# EAGLE design pcb2 (EAGLE 8.0.0)
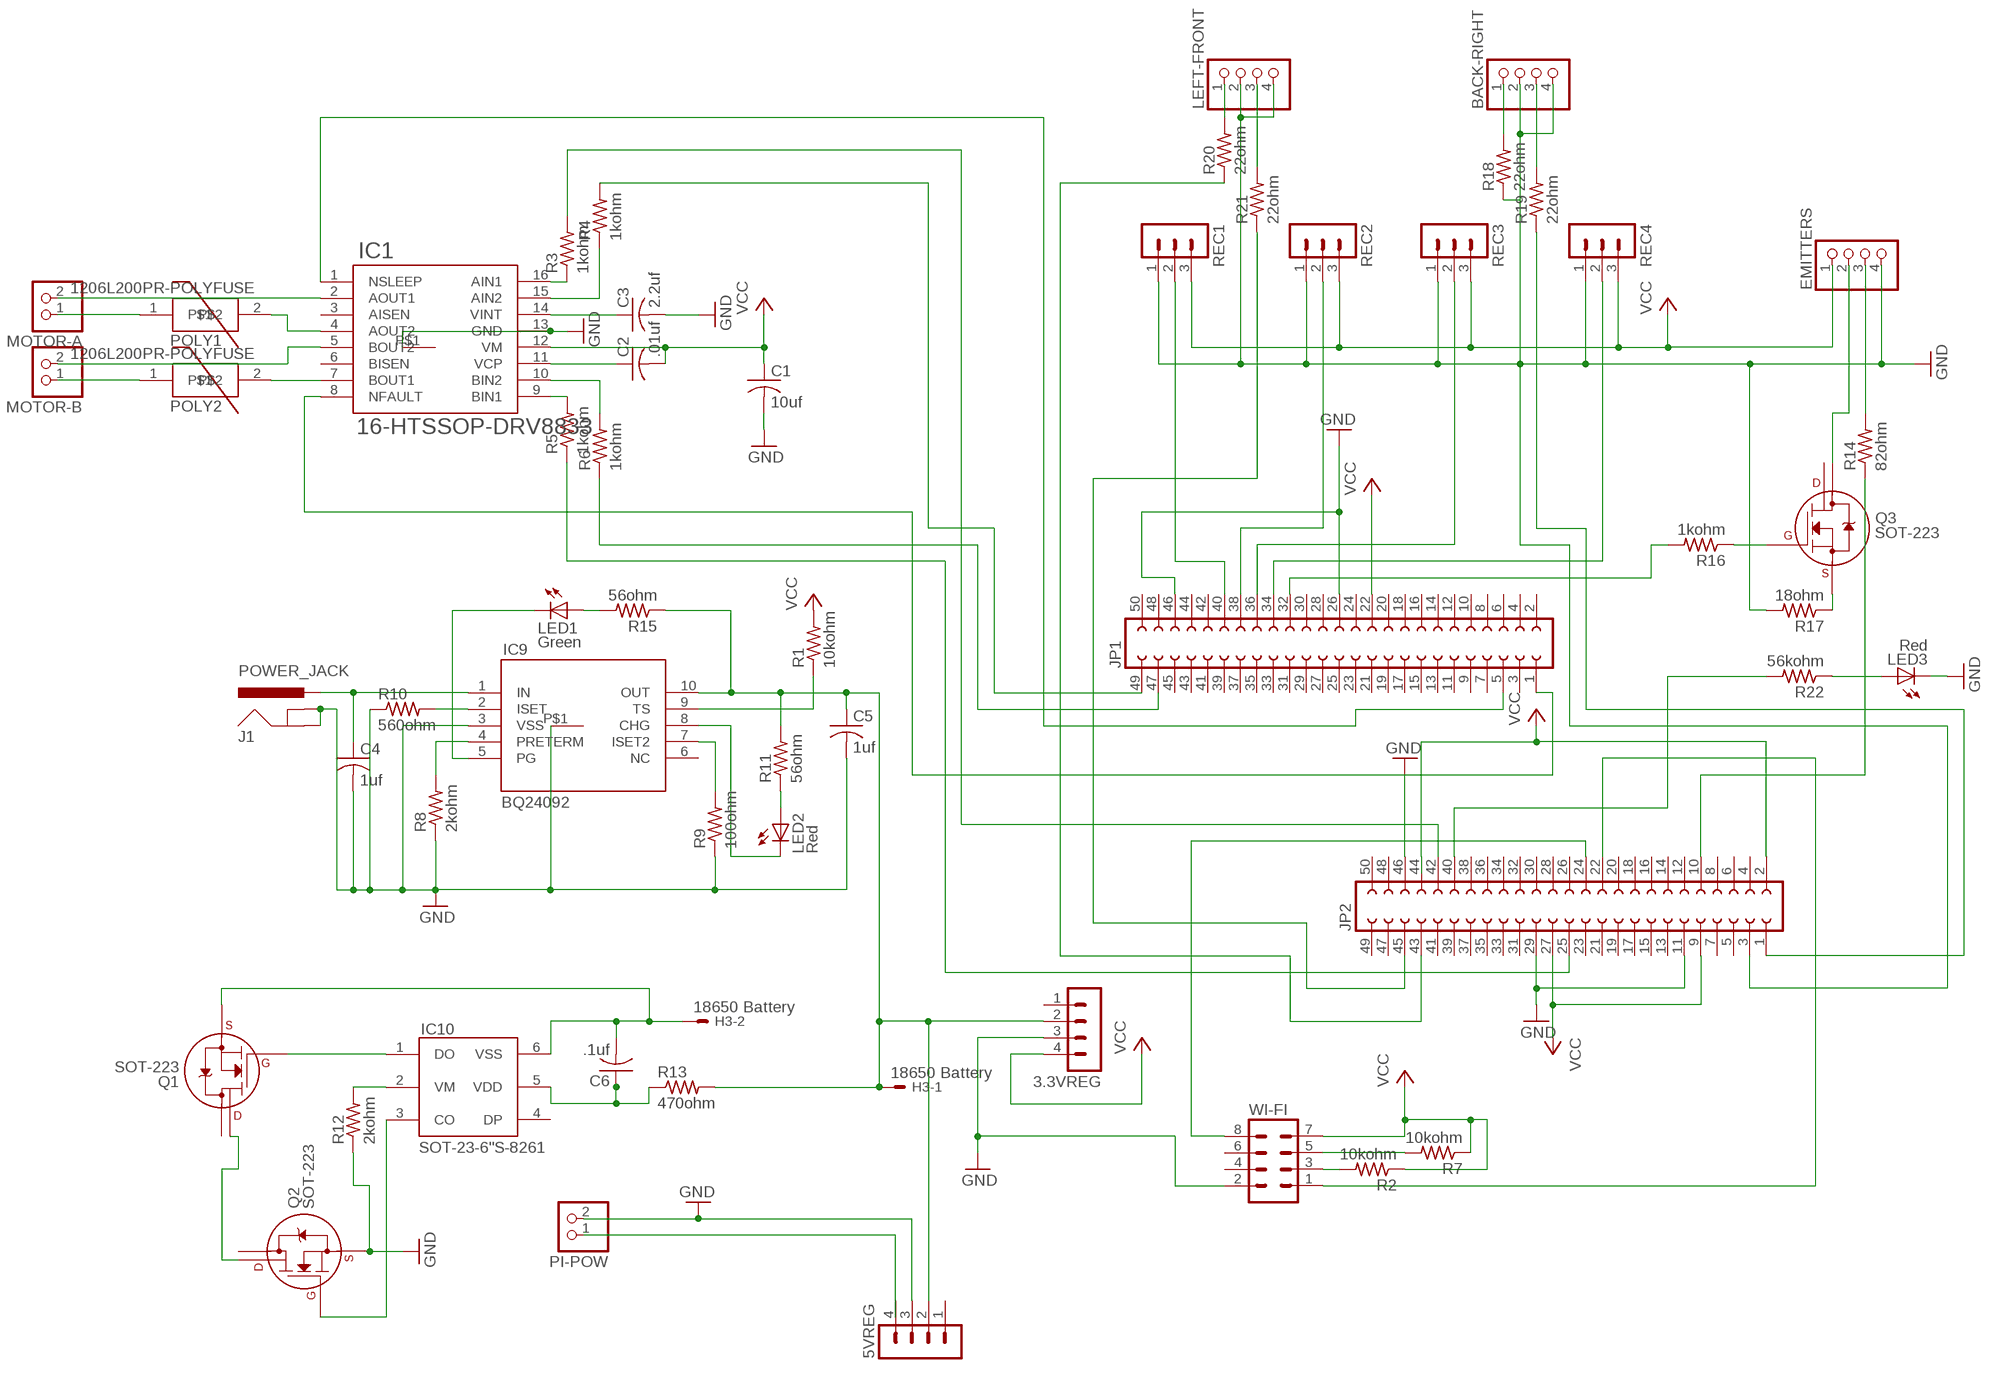
[diagram p0: schematic, sheet 1]

## Parts
3.3VREG  MA04-1  [MA04-1]
5VREG  MA04-1  [MA04-1]
BACK-RIGHT  PINHD-1X4  [1X04]
C1  10uf  C-USC0805  [C0805]
C2  .01uf  C-USC0805  [C0805]
C3  2.2uf  C-USC1206  [C1206]
C4  1uf  C-USC1206  [C1206]
C5  1uf  C-USC1206  [C1206]
C6  .1uf  C-USC1206  [C1206]
EMITTERS  PINHD-1X4  [1X04]
H3  18650 Battery  KK-156-2  [KK-156-2]
IC1  16-HTSSOP-DRV8833  [TSSOP16E]
IC9  BQ24092  [DFN10-3X3]
IC10  SOT-23-6"S-8261  [SOT23-6]
J1  POWER_JACK  [POWER_JACK_PTH]
JP1  FE25-2  [FE25-2]
JP2  FE25-2  [FE25-2]
LED1  Green  LEDCHIPLED_0805  [CHIPLED_0805]
LED2  Red  LEDCHIPLED_0805  [CHIPLED_0805]
LED3  Red  LEDCHIPLED_0805  [CHIPLED_0805]
LEFT-FRONT  PINHD-1X4  [1X04]
MOTOR-A  PINHD-1X2  [1X02]
MOTOR-B  PINHD-1X2  [1X02]
PI-POW  PINHD-1X2  [1X02]
POLY1  1206L200PR-POLYFUSE  [R1206]
POLY2  1206L200PR-POLYFUSE  [R1206]
Q1  SOT-223  IRLL014  [SOT-223]
Q2  SOT-223  IRLL014  [SOT-223]
Q3  SOT-223  IRLL014  [SOT-223]
R1  10kohm  R-US_R0805  [R0805]
R2  10kohm  R-US_R0805  [R0805]
R3  1kohm  R-US_R0805  [R0805]
R4  1kohm  R-US_R0805  [R0805]
R5  1kohm  R-US_R0805  [R0805]
R6  1kohm  R-US_R0805  [R0805]
R7  10kohm  R-US_R0805  [R0805]
R8  2kohm  R-US_R1206  [R1206]
R9  100ohm  R-US_R0805  [R0805]
R10  560ohm  R-US_R1206  [R1206]
R11  56ohm  R-US_R1206  [R1206]
R12  2kohm  R-US_R0805  [R0805]
R13  470ohm  R-US_R1206  [R1206]
R14  82ohm  R-US_R1206  [R1206]
R15  56ohm  R-US_R1206  [R1206]
R16  1kohm  R-US_R1206  [R1206]
R17  18ohm  R-US_R1206  [R1206]
R18  22ohm  R-US_R1206  [R1206]
R19  22ohm  R-US_R1206  [R1206]
R20  22ohm  R-US_R1206  [R1206]
R21  22ohm  R-US_R1206  [R1206]
R22  56kohm  R-US_R0805  [R0805]
REC1  MA03-1  [MA03-1]
REC2  MA03-1  [MA03-1]
REC3  MA03-1  [MA03-1]
REC4  MA03-1  [MA03-1]
WI-FI  MA04-2  [MA04-2]

## Nets
GND: 3.3VREG.3 5VREG.3 BACK-RIGHT.2 BACK-RIGHT.4 C1.2 C3.2 C4.2 C5.2 EMITTERS.4 IC1.13(GND) IC1.P$1 IC9.3(VSS) IC9.P$1 J1.GND J1.GNDBREAK JP1.26 JP1.46 JP2.11 JP2.29 JP2.46 LED3.C LEFT-FRONT.2 LEFT-FRONT.4 PI-POW.2 Q2.3(S) R8.1 R9.1 R10.1 R12.1 R17.2 REC1.1 REC2.1 REC3.1 REC4.1 WI-FI.2
N$1: C3.1 IC1.14(VINT)
N$2: IC10.2(VM) R12.2
N$3: C2.1 IC1.11(VCP)
N$4: IC1.16(AIN1) R3.1
N$5: IC1.15(AIN2) R4.1
N$6: IC9.5(PG) LED1.C
N$7: LED1.A R15.2
N$8: IC9.8(CHG) LED2.C
N$9: LED2.A R11.1
N$10: IC9.2(ISET) R10.2
N$11: IC9.4(PRETERM) R8.2
N$12: IC10.1(DO) Q1.1(G)
N$13: C4.1 IC9.1(IN) J1.PWR
N$14: IC1.9(BIN1) R5.2
N$15: IC10.3(CO) Q2.1(G)
N$16: Q1.4(D2) Q2.4(D2)
N$17: IC9.7(ISET2) R9.2
N$18: C6.2 H3.2 IC10.6(VSS) Q1.3(S)
N$19: Q3.1(G) R16.1
N$20: IC1.10(BIN2) R6.2
N$21: C6.1 IC10.5(VDD) R13.1
N$22: JP2.10 R14.1
N$23: 5VREG.4 PI-POW.1
N$24: EMITTERS.3 R14.2
N$25: IC1.2(AOUT1) MOTOR-A.2
N$26: JP2.24 WI-FI.8
N$27: JP1.40 REC1.2
N$28: JP2.22 WI-FI.1
N$29: JP2.42 R3.2
N$30: JP1.49 R4.2
N$31: JP1.47 R6.1
N$32: JP2.25 R5.1
N$33: IC1.4(AOUT2) POLY1.2
N$34: IC1.5(BOUT2) MOTOR-B.2
N$35: MOTOR-A.1 POLY1.1
N$36: IC9.9(TS) R1.1
N$37: R2.2 WI-FI.3
N$38: 3.3VREG.2 5VREG.2 C5.1 H3.1 IC9.10(OUT) R11.2 R13.2 R15.1
N$39: R7.2 WI-FI.5
N$40: JP1.34 REC4.2
N$41: JP1.36 REC3.2
N$42: JP1.38 REC2.2
N$43: EMITTERS.2 Q3.2(D1)
N$46: MOTOR-B.1 POLY2.1
N$47: IC1.7(BOUT1) POLY2.2
N$48: JP1.32 R16.2
N$49: BACK-RIGHT.1 R18.2
N$50: Q3.3(S) R17.1
N$51: BACK-RIGHT.3 R19.2
N$52: LEFT-FRONT.1 R20.2
N$53: LEFT-FRONT.3 R21.2
N$54: JP2.3 R18.1
N$55: IC1.1(NSLEEP) JP1.5
N$56: IC1.8(NFAULT) JP1.1
N$57: JP2.40 R22.2
N$59: JP2.45 R21.1
N$60: JP2.43 R20.1
N$61: JP2.1 R19.1
N$64: LED3.A R22.1
VCC: 3.3VREG.4 C1.1 C2.2 EMITTERS.1 IC1.12(VM) JP1.22 JP2.2 JP2.9 JP2.27 JP2.44 R1.2 R2.1 R7.1 REC1.3 REC2.3 REC3.3 REC4.3 WI-FI.7
Unconnected: 3.3VREG.1 5VREG.1 IC1.3(AISEN) IC1.6(BISEN) IC9.6(NC) IC10.4(DP) JP1.2 JP1.3 JP1.4 JP1.6 JP1.7 JP1.8 JP1.9 JP1.10 JP1.11 JP1.12 JP1.13 JP1.14 JP1.15 JP1.16 JP1.17 JP1.18 JP1.19 JP1.20 JP1.21 JP1.23 JP1.24 JP1.25 JP1.27 JP1.28 JP1.29 JP1.30 JP1.31 JP1.33 JP1.35 JP1.37 JP1.39 JP1.41 JP1.42 JP1.43 JP1.44 JP1.45 JP1.48 JP1.50 JP2.4 JP2.5 JP2.6 JP2.7 JP2.8 JP2.12 JP2.13 JP2.14 JP2.15 JP2.16 JP2.17 JP2.18 JP2.19 JP2.20 JP2.21 JP2.23 JP2.26 JP2.28 JP2.30 JP2.31 JP2.32 JP2.33 JP2.34 JP2.35 JP2.36 JP2.37 JP2.38 JP2.39 JP2.41 JP2.47 JP2.48 JP2.49 JP2.50 Q1.2(D1) Q2.2(D1) Q3.4(D2) WI-FI.4 WI-FI.6

## Library data of the parts
3.3VREG 5VREG = con-lstb:MA04-1: PIN HEADER; OC_FARNELL: unknown; OC_NEWARK: unknown
BACK-RIGHT EMITTERS LEFT-FRONT = pinhead:PINHD-1X4: PIN HEADER
C1-C6 = rcl:C-US: CAPACITOR, American symbol
H3 = con-molex:KK-156-2: KK 156 HEADER Source: http://www.molex.com/pdm_docs/sd/026604100_sd.pdf; OC_FARNELL: unknown; OC_NEWARK: unknown
IC1 = ECE477_project:16-HTSSOP
IC9 = ECE477_project:BQ24092
IC10 = ECE477_project:SOT-23-6
J1 = SparkFun-Connectors:POWER_JACK: Power Jack Connector This is the standard 5.5mm barrel jack for power. The PTH is the most common, proven, reliable, footprint. The Slot footprint only works if the mill layer is transmitted to the PCB fab house so be warned. Here are the connectors we sell at SparkFun: DC Barrel Power Jack/Connector <https://www.sparkfun.com/products/119> (PRT-00119) DC Barrel Power Jack/Connector (SMD) <https://www.sparkfun.com/products/12748> (PRT-12748) DC Barrel Jack Adapter - Breadboard Compatible <https://www.sparkfun.com/products/10811> (PRT-10811) It is used on this SparkFun product (and many, many others): SparkFun RedBoard - Programmed with Arduino <https://www.sparkfun.com/products/12757> (DEV-12757) Also, if you need a mating power supply or connector, please check these out: Wall Adapter Power Supply - 9VDC 650mA <https://www.sparkfun.com/products/298> (TOL-00298) DC Barrel Jack Adapter - Male <https://www.sparkfun.com/products/10287> (PRT-10287); PROD_ID: CONN-08197
JP1 JP2 = con-lsta:FE25-2: FEMALE HEADER; OC_FARNELL: unknown; OC_NEWARK: unknown
LED1-LED3 = led:LED: LED OSRAM: - CHIPLED LG R971, LG N971, LY N971, LG Q971, LY Q971, LO R971, LY R971 LH N974, LH R974 LS Q976, LO Q976, LY Q976 LO Q996 - Hyper CHIPLED LW Q18S LB Q993, LB Q99A, LB R99A - SideLED LS A670, LO A670, LY A670, LG A670, LP A670 LB A673, LV A673, LT A673, LW A673 LH A674 LY A675 LS A676, LA A676, LO A676, LY A676, LW A676 LS A679, LY A679, LG A679 - Hyper Micro SIDELED® LS Y876, LA Y876, LO Y876, LY Y876 LT Y87S - SmartLED LW L88C, LW L88S LB L89C, LB L89S, LG L890 LS L89K, LO L89K, LY L89K LS L896, LA L896, LO L896, LY L896 - TOPLED LS T670, LO T670, LY T670, LG T670, LP T670 LSG T670, LSP T670, LSY T670, LOP T670, LYG T670 LG T671, LOG T671, LSG T671 LB T673, LV T673, LT T673, LW T673 LH T674 LS T676, LA T676, LO T676, LY T676, LB T676, LH T676, LSB T676, LW T676 LB T67C, LV T67C, LT T67C, LS T67K, LO T67K, LY T67K, LW E67C LS E67B, LA E67B, LO E67B, LY E67B, LB E67C, LV E67C, LT E67C LW T67C LS T679, LY T679, LG T679 LS T770, LO T770, LY T770, LG T770, LP T770 LB T773, LV T773, LT T773, LW T773 LH T774 LS E675, LA E675, LY E675, LS T675 LS T776, LA T776, LO T776, LY T776, LB T776 LHGB T686 LT T68C, LB T68C - Hyper Mini TOPLED® LB M676 - Mini TOPLED Santana® LG M470 LS M47K, LO M47K, LY M47K Source: http://www.osram.convergy.de LUXEON: - LUMILED® LXK2-PW12-R00, LXK2-PW12-S00, LXK2-PW14-U00, LXK2-PW14-V00 LXK2-PM12-R00, LXK2-PM12-S00, LXK2-PM14-U00 LXK2-PE12-Q00, LXK2-PE12-R00, LXK2-PE12-S00, LXK2-PE14-T00, LXK2-PE14-U00 LXK2-PB12-K00, LXK2-PB12-L00, LXK2-PB12-M00, LXK2-PB14-N00, LXK2-PB14-P00, LXK2-PB14-Q00 LXK2-PR12-L00, LXK2-PR12-M00, LXK2-PR14-Q00, LXK2-PR14-R00 LXK2-PD12-Q00, LXK2-PD12-R00, LXK2-PD12-S00 LXK2-PH12-R00, LXK2-PH12-S00 LXK2-PL12-P00, LXK2-PL12-Q00, LXK2-PL12-R00 Source: www.luxeon.com KINGBRIGHT: KA-3528ASYC Source: www.kingbright.com
MOTOR-A MOTOR-B PI-POW = pinhead:PINHD-1X2: PIN HEADER
POLY1 POLY2 = ECE477_project:1206L200PR
Q1-Q3 = transistors:IRLL*: International Rectifier IRLL series N-channel enhancement mode MOSFET HEXFET Power MOSFET SOT-223 Includes body diode
R1-R22 = rcl:R-US_: RESISTOR, American symbol
REC1-REC4 = con-lstb:MA03-1: PIN HEADER; OC_FARNELL: unknown; OC_NEWARK: unknown
WI-FI = con-lstb:MA04-2: PIN HEADER; OC_FARNELL: unknown; OC_NEWARK: unknown

## Board
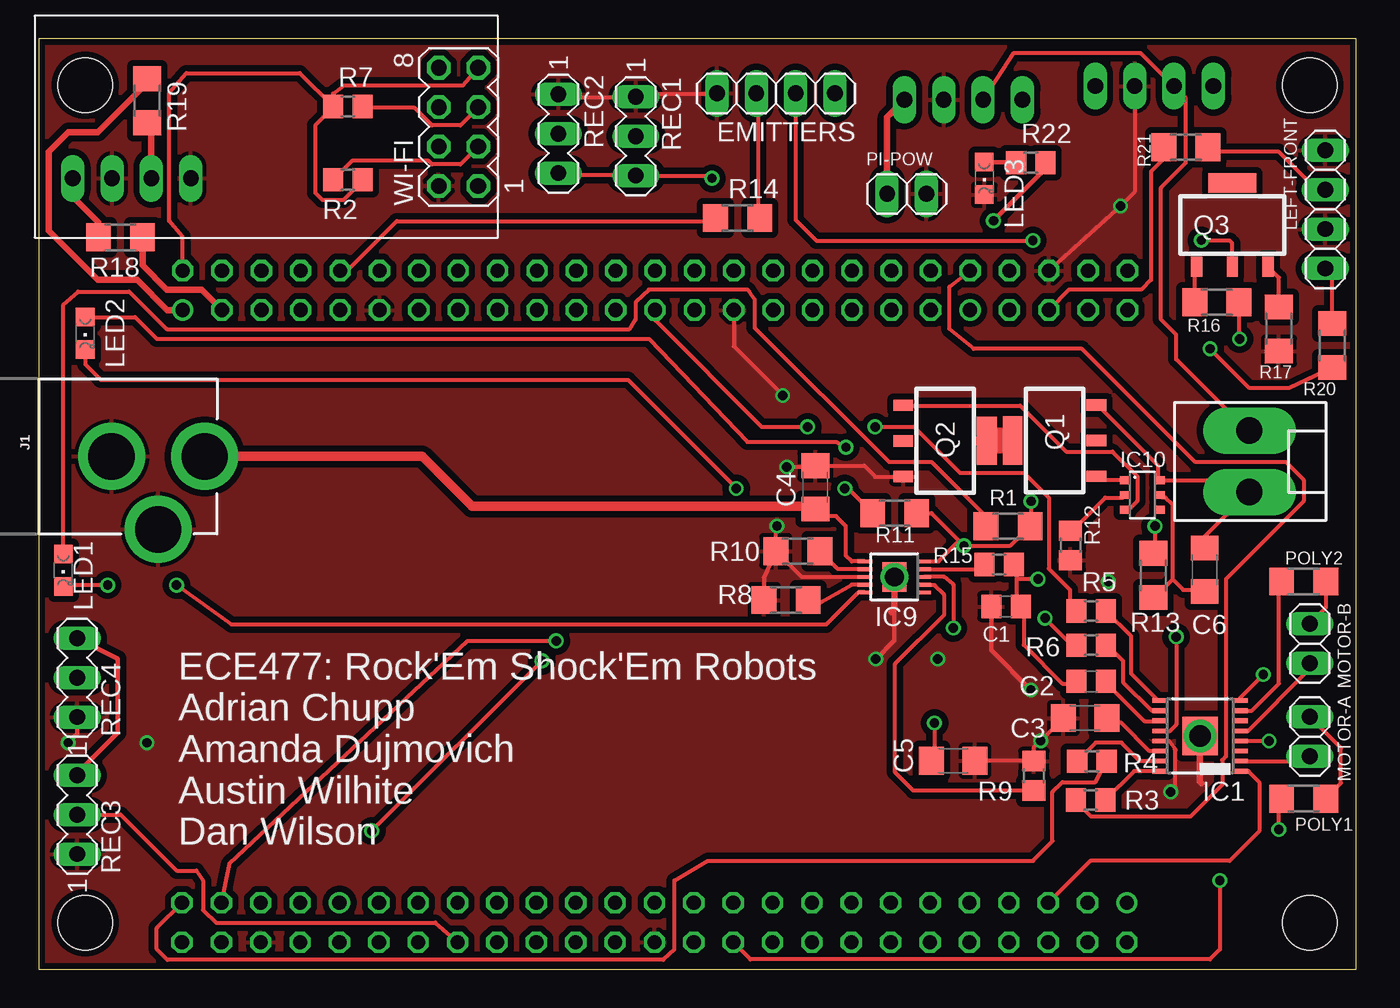
[diagram p1: board, top side]
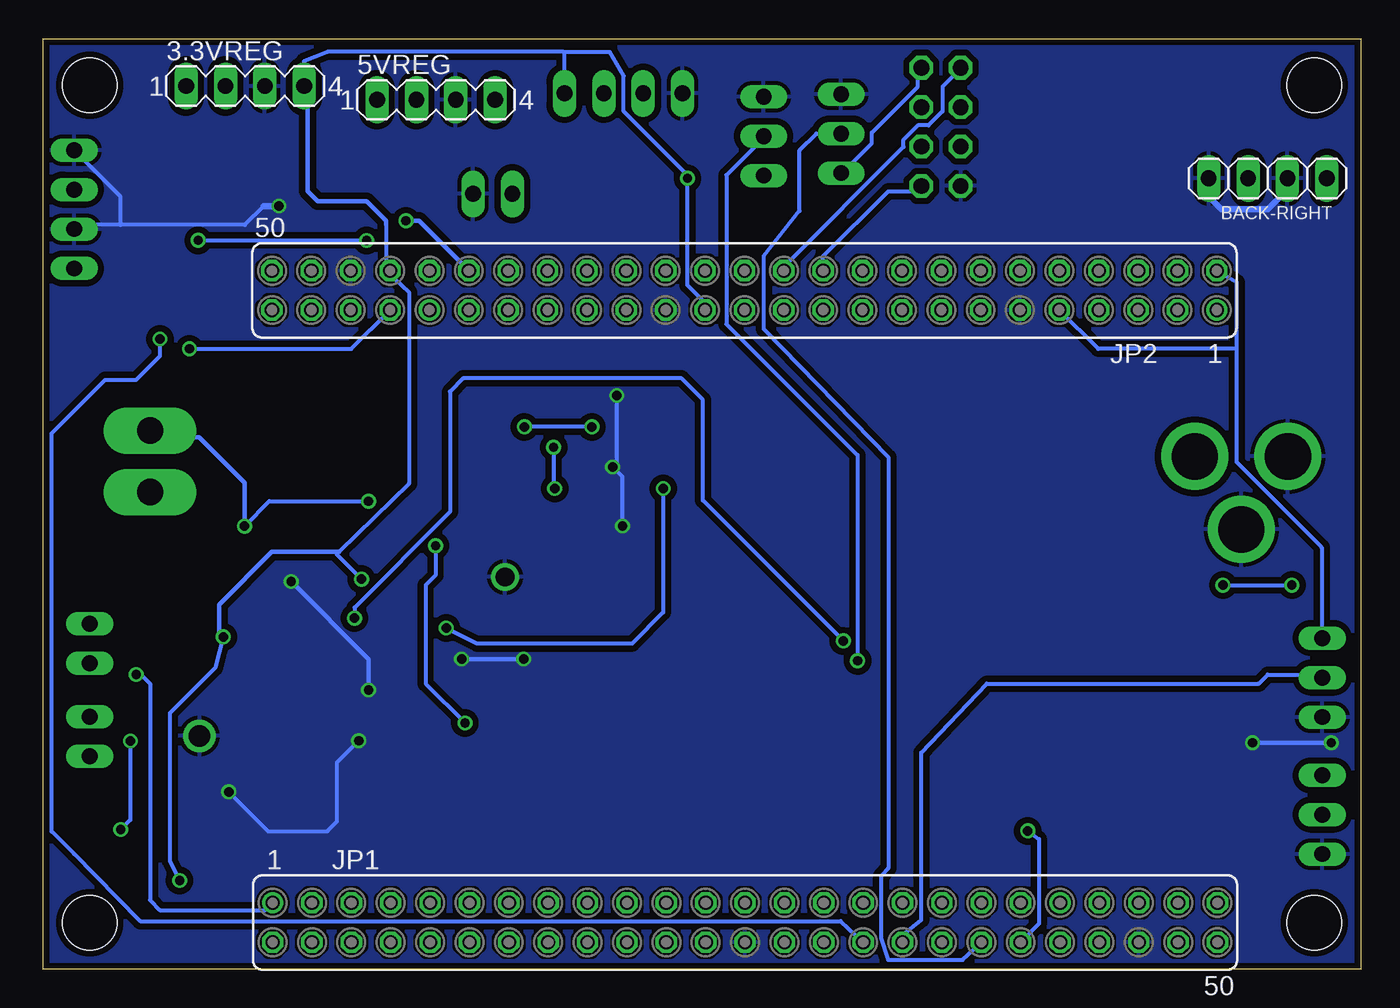
[diagram p2: board, bottom side, seen from below]

Size 85 x 60 mm. Coordinates in mm from the lower left corner, seen from the top.
Outline: 0,0 85,0 85,60 0,60 0,0
Copper layers (1*16): Top 0.0356mm / dielectric 1.5011mm / Bottom 0.0356mm
Design rules "ECE_Senior_Design": minimum track width 8mil, minimum drill 13mil, track to track 8mil, track to pad 8mil, pad to pad 6mil, via to via 8mil, smd to smd 6mil, copper to edge 15mil, drill to drill 8mil, minimum pad ring 7mil, minimum via ring 7mil, stop-mask expansion 3mil, vias tented up to drill 0mil, thermal gap 10mil
Holes 3.5 mm at 3,57 82,57 82,3 3,3

### Footprints (pad centres in the part's own frame; a part is rotated, then mirrored left to right if it is on the bottom)
MA04-1 = drill 1.016 long: 1 -3.81,0; 2 -1.27,0; 3 1.27,0; 4 3.81,0
1X04 = drill 1.016 long: 1 -3.81,0; 2 -1.27,0; 3 1.27,0; 4 3.81,0
C0805 = smd 1.3 x 1.5: 1 -0.95,0; 2 0.95,0
C1206 = smd 1.6 x 1.8: 1 -1.4,0; 2 1.4,0
KK-156-2 = drill 1.7 pad 3 long: 1 -1.98,0; 2 1.98,0
TSSOP16E = smd 0.3 x 1: 1 -2.275,-2.565; 2 -1.625,-2.565; 3 -0.975,-2.565; 4 -0.325,-2.565; 5 0.325,-2.565; 6 0.975,-2.565; 7 1.625,-2.565; 8 2.275,-2.565; 9 2.275,2.565; 10 1.625,2.565; 11 0.975,2.565; 12 0.325,2.565; 13 -0.325,2.565; 14 -0.975,2.565; 15 -1.625,2.565; 16 -2.275,2.565 | smd 2.46 x 2.31: EXP 0,0 | drill 1.4 pad 1.93: P$1 0,0
DFN10-3X3 = smd 0.25 x 1: 1 -1,-1.9; 2 -0.5,-1.9; 3 0,-1.9; 4 0.5,-1.9; 5 1,-1.9; 6 1,1.9; 7 0.5,1.9; 8 0,1.9; 9 -0.5,1.9; 10 -1,1.9 | smd 1.88 x 1.57: EXP 0,0 | drill 1.2 pad 1.676: P$1 0,0
SOT23-6 = smd 0.5 x 0.6: 1 -0.95,-1.15; 2 0,-1.15; 3 0.95,-1.15; 4 0.95,1.15; 5 0,1.15; 6 -0.95,1.15
POWER_JACK_PTH = drill 2.997 pad 4.318: GND 0,7.7; GNDBREAK 4.7,10.7; PWR 0,13.7
FE25-2 = drill 0.914: 1 -30.48,1.27; 41 20.32,1.27 | drill 0.914 octagon: 2 -30.48,-1.27; 3 -27.94,1.27; 4 -27.94,-1.27; 5 -25.4,1.27; 6 -25.4,-1.27; 7 -22.86,1.27; 8 -22.86,-1.27; 9 -20.32,1.27; 10 -20.32,-1.27; 11 -17.78,1.27; 12 -17.78,-1.27; 13 -15.24,1.27; 14 -15.24,-1.27; 15 -12.7,1.27; 16 -12.7,-1.27; 17 -10.16,1.27; 18 -10.16,-1.27; 19 -7.62,1.27; 20 -7.62,-1.27; 21 -5.08,1.27; 22 -5.08,-1.27; 23 -2.54,1.27; 24 -2.54,-1.27; 25 0,1.27; 26 0,-1.27; 27 2.54,1.27; 28 2.54,-1.27; 29 5.08,1.27; 30 5.08,-1.27; 31 7.62,1.27; 32 7.62,-1.27; 33 10.16,1.27; 34 10.16,-1.27; 35 12.7,1.27; 36 12.7,-1.27; 37 15.24,1.27; 38 15.24,-1.27; 39 17.78,1.27; 40 17.78,-1.27; 42 20.32,-1.27; 43 22.86,1.27; 44 22.86,-1.27; 45 25.4,1.27; 46 25.4,-1.27; 47 27.94,1.27; 48 27.94,-1.27; 49 30.48,1.27; 50 30.48,-1.27
CHIPLED_0805 = smd 1.2 x 1.2: A 0,-1.05; C 0,1.05
1X02 = drill 1.016 long: 1 -1.27,0; 2 1.27,0
R1206 = smd 1.6 x 1.803: 1 -1.422,0; 2 1.422,0
SOT-223 = smd 0.73 x 1.27: 1 -2.3,-2.7; 2 0,-2.7; 3 2.3,-2.7 | smd 3.1 x 1.27: 4 0,2.7
R0805 = smd 1.3 x 1.5: 1 -0.95,0; 2 0.95,0
MA03-1 = drill 1.016 long: 1 -2.54,0; 2 0,0; 3 2.54,0
MA04-2 = drill 1.016 octagon: 1 -3.81,-1.27; 2 -3.81,1.27; 3 -1.27,-1.27; 4 -1.27,1.27; 5 1.27,-1.27; 6 1.27,1.27; 7 3.81,-1.27; 8 3.81,1.27

### Placement (x,y rotation side)
3.3VREG  71.97,56.95 0 bottom
5VREG  59.66,56.06 0 bottom
BACK-RIGHT  6,51 180 bottom
C1  62.4,23.39 180 top
C2  67.9,18.56 180 top
C3  67.5,16.2 180 top
C4  50.1,31.07 90 top
C5  58.99,13.44 0 top
C6  75.21,25.76 90 top
EMITTERS  47.56,56.48 180 top
H3  78.1,32.75 270 top
IC1  74.92,15.04 90 top
IC9  55.2,25.29 270 top
IC10  71.2,30.58 270 top
J1  -3,33.06 270 top
JP1  39.72,3.01 0 bottom
JP2  39.76,43.78 180 bottom
LED1  1.58,25.72 180 top
LED2  3,41 180 top
LED3  61,51 180 top
LEFT-FRONT  83,49 90 top
MOTOR-A  82,15 270 top
MOTOR-B  82,21 270 top
PI-POW  56,50 0 top
POLY1  81.6,11 180 top
POLY2  81.6,25 180 top
Q1  65.53,34.09 90 top
Q2  58.47,34.07 270 top
Q3  77,48 0 top
R1  61.95,26.09 0 top
R2  19.94,50.91 180 top
R3  67.86,10.91 180 top
R4  67.94,13.41 0 top
R5  67.9,23.09 0 top
R6  67.9,20.89 0 top
R7  19.94,55.64 0 top
R8  48.22,23.8 0 top
R9  64.2,12.47 270 top
R10  48.98,26.95 0 top
R11  55.22,29.41 0 top
R12  66.56,27.33 90 top
R13  71.91,25.39 90 top
R14  45.09,48.44 0 top
R15  62.53,28.56 180 top
R16  76,43 0 top
R17  80,41.28 270 top
R18  5.27,47.19 180 top
R19  7,56 270 top
R20  83.44,40.22 90 top
R21  74,53 0 top
R22  64,52 0 top
REC1  38.52,53.72 270 top
REC2  33.52,53.88 270 top
REC3  2.48,9.96 90 top
REC4  2.48,18.8 90 top
WI-FI  27.08,54.32 90 top

### Tracks (layer width: path | path; a pad name or v marks a point on that pad's centre or on a via)
GND  (via drill 0.6, 0.6 pad 0.25)
  Top 0.254: 65.15,44.81 JP2.46 | 70.64,56.78 3.3VREG.3 70.7,50.12 v69.79,49.21 JP2.46 | REC2.1 33.6,56.24 38.41,56.24 REC1.1 38.63,56.46 43.66,56.46 EMITTERS.4 | Q2.3 55.75,31.75 53.98,31.75 53.26,32.47 C4.2 50.02,32.38 v48.26,32.38 | R10.1 47.43,26.83 | R8.1 46.79,25.2 R10.1 | R10.1 47.55,28.5 v47.62,28.57 | IC9.3 49.22,25.29 R10.1 | JP2.46 65.16,44.84 | C5.2 64.18,13.44 R9.1 64.2,14.29 v64.64,14.73 C3.2 | JP2.29 44.84,40.16 v48,37 | IC1.13 72.92,14.71 73.28,14.2 | 73.28,14.2 73.35,14.1 | 73.28,14.2 73.28,11.69 v73.03,11.43
  Top 0.305: 55.2,23.2 55.2,21.2 v54,20 | C1.2 61.45,20.55 v64,18 | REC4.1 2.48,15.18 v1.91,14.61
  Top 0.406: IC1.P$1 74.92,12.08 75,12 | IC9.P$1 55.2,23.2 55,23
  Bottom 0.254: v47.62,28.57 47.62,31.75 v48.26,32.38 48,32.65 v48,37 | v73.03,11.43 70.48,8.89 66.67,8.89 66.04,9.53 66.04,13.34 v64.64,14.73 | 70.79,49.21 72,48 80,48 | 80,48 82.73,48 LEFT-FRONT.2 | 80,48 80,49.81 LEFT-FRONT.4
  Bottom 0.305: v54,20 v58,20 | v64,18 64,20 v69,25 | v1.91,14.61 v6.99,14.61
  Bottom 0.406: v69.79,49.21 70.79,49.21 | BACK-RIGHT.2 4.73,50.27 6,49 9,49 10,50 10,50.81 BACK-RIGHT.4
  pour Bottom (isolate 0.406): 0,0 0,60 85,60 85,0
  pour Top (isolate 0.406): 0,0 85,0 85,60 0,60
N$1
  Top 0.254: IC1.14 71.66,14.06 69.85,15.88 69.22,15.88 C3.1
N$2
  Top 0.254: IC10.2 69.95,30.4 68.81,30.4 66.75,28.35 R12.2
N$3
  Top 0.254: IC1.11 72.24,16 71.32,16 68.81,18.52 C2.1
N$4
  Top 0.254: IC1.16 70.67,12.77 R3.1
N$5
  Top 0.254: IC1.15 71.04,13.41 69.85,14.61 68.19,14.61 R4.1
N$6  (via drill 0.6 pad 0.25)
  Top 0.254: IC9.5 52.87,24.29 50.8,22.23 12.43,22.23 v8.89,24.77 | v4.45,24.77 1.68,24.77 LED1.C
  Bottom 0.254: v8.89,24.77 v4.45,24.77
N$7
  Top 0.254: 1.6,26.98 LED1.A 1.58,42.86 2.54,43.7 5.83,43.7 8.26,41.27 38.1,41.27 38.5,41.91 38.5,43 39.37,43.81 45.72,43.81 45.84,43.7 46.18,43.18 46.18,41.38 54.86,32.69 57.61,32.69 61.04,29.26 61.04,28.57 R15.2
N$8  (via drill 0.6)
  Top 0.254: LED2.C 3,39 4,38 38,38 v45,31 | v59,22 59,24.82 58.42,25.3 57.21,25.3 IC9.8
  Bottom 0.254: v45,31 45,23 47,21 57,21 v59,22
N$9  (via drill 0.6 pad 0.25)
  Top 0.254: LED2.A 6.21,42.05 7.62,40.64 39.37,40.64 45.72,34 51.44,34 v52.07,33.66 | v52,31 52.2,31 R11.1
  Bottom 0.254: v52.07,33.66 52.07,31.07 v52,31
N$10
  Top 0.254: IC9.2 51.56,25.79 R10.2
N$11
  Top 0.254: IC9.4 52.46,24.79 50.16,23.5 49.95,23.5 R8.2
N$12
  Top 0.254: IC10.1 69.95,31.55 68.58,31.55 68.35,31.77 Q1.1
N$13
  Top 0.254: IC9.1 52.45,26.29 52.07,26.67 52.07,28.57 51.44,29.21 50.56,29.21 C4.1
  Top 0.61: J1.PWR 24.72,33.06 27.94,29.84 49.92,29.84
  Top 1.016: C4.1 49.92,29.84
N$14
  Top 0.254: IC1.9 72.22,17.32 70.48,19.05 70.48,21.45 R5.2
N$15
  Top 0.254: IC10.3 70.18,29.72 70.41,29.72 70.87,30.18 70.87,31.77 69.27,33.38 66.29,33.38 63.32,36.35 55.78,36.35 Q2.1
N$16
  Top 0.254: 61.27,34.06 Q2.4 | 62.64,34.06 Q1.4
  Top 1.676: 62.64,34.06 61.27,34.06
N$17
  Top 0.254: R9.2 56.42,11.52 55.24,12.7 55.24,19.68 58.42,22.86 58.42,24.13 57.78,24.77 57.12,24.77 IC9.7
N$18
  Top 0.254: Q1.3 68.35,36.35 72.24,32.46 72.24,31.55 IC10.6 77.34,31.53 H3.2 75.21,27.88 C6.2
N$19
  Top 0.254: R16.1 74.58,45.18 Q3.1
N$20
  Top 0.254: IC1.10 72.24,16.69 71.78,16.69 69.95,18.52 69.95,19.89 69.04,20.8 R6.2
N$21
  Top 0.254: 73.15,25.15 73.15,29.95 72.69,30.4 72.47,30.4 IC10.5 | 73.15,25.15 72.01,24 R13.1 | 73.15,25.15 73.84,24.46 75.21,24.46 C6.1
N$22
  Top 0.254: R14.1 43.66,48.23 23.09,48.23 19.66,44.81 JP2.10
N$23
  Top 0.406: PI-POW.1 54.73,54.95 5VREG.4
N$24
  Top 0.254: R14.2 46.41,48.46 46.41,56.46 EMITTERS.3
N$25
  Top 0.254: IC1.2 81.69,13.41 MOTOR-A.2
N$26
  Bottom 0.254: WI-FI.8 25.83,58.06 26.98,56.92 26.98,55.32 27.89,54.41 28.57,54.41 29.49,53.49 29.49,53.03 37.22,45.3 JP2.24
N$27  (via drill 0.61)
  Top 0.254: v32.46,19.89 v21.49,8.91
  Bottom 0.254: v32.46,19.89 32.46,33.15 40.92,41.6 40.92,51.21 38.63,53.49 REC1.2 | v21.49,8.91 20.75,8.38 20.75,2.93 JP1.40
N$28
  Bottom 0.254: 28.57,50.29 WI-FI.1 28.7,50.16 30.48,50.16 34.68,45.97 JP2.22
N$29
  Top 0.254: R3.2 66.98,10.74 67.89,9.83 74.3,9.83 76.35,11.89 76.35,13.49 76.58,13.72 76.58,25.15 81.61,30.18 81.61,31.55 80.47,32.69 74.62,32.69 67.31,40.01 60.33,40.01 58.75,41.27 58.75,44.02 JP2.42
N$30
  Top 0.254: R4.2 68.18,12.06 66.04,12.06 65.41,11.43 65.41,8.26 64.14,6.99 43.18,6.99 41,5.71 41,1.27 40.27,0.6 8.29,0.6 7.62,1.27 7.62,2.66 JP1.49
N$31  (via drill 0.61)
  Top 0.254: v64.92,22.63 66.52,21.03 66.98,21.03 R6.1 | v33.38,21.17 27.66,21.17 12.29,6.8 JP1.47
  Bottom 0.254: v64.92,22.63 64.92,23.32 58.75,29.49 58.75,37.25 57.9,38.1 43.81,38.1 42.43,36.72 42.43,30.23 v33.38,21.17
N$32  (via drill 0.61)
  Top 0.254: v53.95,34.98 56.46,34.98 59.44,32 63.55,32 65.15,30.4 65.15,25.83 66.52,24.46 66.52,23.32 R5.1 | v49.61,34.98 46.63,34.98 39.78,41.83 JP2.25
  Bottom 0.254: v49.61,34.98 v53.95,34.98
N$33  (via drill 0.6)
  Top 0.254: IC1.4 79,14.71 | v79.38,14.71 79,14.71 | v79.38,14.71 79.44,14.71 | 79,14.71 v79.38,14.71 | v80,9 80,10.82 POLY1.2
  Bottom 0.254: v79.38,14.71 79.38,9.62 v80,9
N$34
  Top 0.254: IC1.5 77.5,15.32 77.95,15.32 81.84,19.2 81.84,19.66 MOTOR-B.2
N$35
  Top 0.254: POLY1.1 83.02,11.02 84,12 84,14.27 MOTOR-A.1
N$36
  Top 0.254: IC9.9 60.7,25.79 R1.1
N$37
  Top 0.254: 19.2,50.98 R2.2 20.2,52.12 25.15,52.12 25.38,51.89 27.2,51.89 28.35,53.03 WI-FI.3
N$38  (via drill 0.6, 0.61)
  Top 0.254: 5VREG.2 61.04,56.24 62.87,59.06 71.09,59.06 73.15,57.01 3.3VREG.2 | v72.01,28.57 72.01,26.98 R13.2 | 73.38,56.78 3.3VREG.2 | H3.1 77.95,34.75 73.38,39.32 73.38,40.92 72.39,41.91 72.39,50.39 74,52 74,56.19 3.3VREG.2 | v64.01,30.18 64.01,28.57 R15.1 62.7,27.3 v59.69,27.3 59.37,27.62 | R11.2 57.59,29.41 59.37,27.62 | IC9.10 58.04,26.29 59.37,27.62 | v57.78,15.88 57.78,13.63 C5.1
  Bottom 0.254: v64.01,30.18 70.41,30.18 v72.01,28.57 | v59.69,27.3 59.69,25.4 60.33,24.77 60.33,18.41 v57.78,15.88
  Bottom 0.305: v72.01,28.57 72.01,31.37 74.93,34.29 77.66,34.29 H3.1
N$39
  Top 0.254: R7.2 21.03,55.55 24.23,55.55 25.38,54.41 27.2,54.41 28.35,55.55 WI-FI.5
N$40
  Bottom 0.254: 2.52,18.75 REC4.2 2.68,19 6,19 6.58,18.41 24.13,18.41 28.35,13.97 28.35,3.17 29.55,2.21 JP1.34
N$41
  Top 0.254: REC3.2 5.28,9.96 8.89,6.35 10.16,6.35 10.6,5.71 10.6,3.81 11.43,3 25.58,3 JP1.36
N$42
  Bottom 0.254: REC2.2 35.12,53.88 36.2,52.8 36.2,48.9 38.5,46 38.5,41.27 30.48,33.02 30.48,6.52 30.95,6 30.95,2 30.5,0.6 25.68,0.6 JP1.38
N$43  (via drill 0.6)
  Top 0.254: Q3.2 77,46.83 76.83,46.99 v75.01,46.99 v75,47 | v64.14,46.99 50.16,46.99 48.83,48.33 EMITTERS.2
  Bottom 0.254: v75,47 v64.14,47 v64.14,46.99
N$46
  Top 0.254: POLY2.1 83.02,23.29 MOTOR-B.1
N$47
  Top 0.254: IC1.7 78.26,16.66 80.01,18.41 80.01,24.83 POLY2.2
N$48  (via drill 0.6)
  Top 0.254: R16.2 77.42,40.69 v77.47,40.64
  Bottom 0.254: v77.47,40.64 77.47,39.53 79,38 81,38 84.45,34.55 84.45,8.89 83,7.43 78.74,3.1 33.55,3.1 JP1.32
N$49
  Top 0.406: R18.2 3.85,48.15 2,50 2,50.81 BACK-RIGHT.1
N$50
  Top 0.254: R17.1 80,44.59 Q3.3
N$51
  Top 0.406: BACK-RIGHT.3 7.27,54.31 R19.2
N$52
  Top 0.254: R20.2 83.44,44.74 LEFT-FRONT.1
N$53
  Top 0.254: LEFT-FRONT.3 82.44,50.27 80.01,52.7 75.72,52.7 R21.2
N$54
  Top 0.406: R18.1 6.69,45.38 8.26,43.81 10.51,43.81 JP2.3
N$55
  Top 0.254: IC1.1 78.04,12.77 78.74,12.06 78.74,8.89 76.83,6.99 67.83,6.99 JP1.5
N$56  (via drill 0.6)
  Top 0.254: IC1.8 77.48,17.48 v79,19
  Bottom 0.254: v79,19 78.69,19 78.11,18.41 78.11,4.45 77.47,3.81 70.67,3.81 JP1.1
N$57  (via drill 0.6)
  Top 0.305: R22.2 64.95,51.62 v61.59,48.26
  Bottom 0.305: v61.59,48.26 60.75,48.26 JP2.40
N$59
  Top 0.254: R21.1 72.58,52.26 71.75,51.44 71.75,44.45 71.12,43.81 66.47,43.81 JP2.45
N$60  (via drill 0.6)
  Top 0.254: R20.1 80.64,37.47 78.11,37.47 v75.56,40.01
  Bottom 0.254: v75.56,40.01 65.12,40.01 JP2.43
N$61
  Top 0.406: R19.1 7,57.16 3.81,53.98 1.91,53.98 0.64,52.7 0.64,47.62 3.81,44.45 6.35,44.45 8.29,42.51 JP2.1
N$64
  Top 0.305: LED3.A 63,52.05 R22.1
VCC  (via drill 0.6, 0.6 pad 0.25, 0.61)
  Top 0.254: 63.09,25.15 63.09,23.77 63.32,23.55 C1.1 63.55,23.32 63.55,20.9 66.04,18.41 66.81,18.41 C2.2 66.75,18.75 | 63.09,25.15 63.09,26.06 R1.2 | v73.38,21.43 73.38,15.77 72.92,15.32 72.47,15.32 IC1.12 | v64.47,25.15 63.09,25.15 | R2.1 20.8,50.75 19.66,49.61 18.29,49.61 17.83,50.06 17.83,54.41 18.97,55.55 R7.1 | REC2.3 33.6,51.21 38.41,51.21 REC1.3 43.25,51.18 v43.43,51 | 19.2,55.78 R7.1 | 2.52,12.34 REC3.3 | R7.1 18.99,56.45 19.68,57 27.37,57 WI-FI.7 | JP2.2 9.28,47.23 8.4,48.26 8.4,56.52 9.53,57.78 16.84,57.78 R7.1 | v76.2,5.71 76.2,1.27 75.56,0.64 45.9,0.64 JP1.22
  Top 0.305: REC3.3 2.48,12.64 5.08,15.24 5.08,20.01 REC4.3
  Bottom 0.254: v64.47,25.15 66.06,26.75 65.91,26.9 61.4,31.32 61.4,43.66 62.41,44.58 JP2.44 62.87,44.83 62.87,48 | 38.41,51.21 REC1.3 | WI-FI.7 28.57,58.06 28.57,56.92 31.55,53.95 31.55,53.26 33.38,51.44 REC2.3 | REC4.3 2.52,21.49 2.52,27.2 8,32.69 8,40 | 51.44,59.16 66.67,59.16 68.16,58.57 3.3VREG.4 | 51.44,59.16 48.46,59.16 47.55,57.61 47.55,55.32 43.43,51.21 v43.43,51 43.43,44.12 42.3,42.99 JP2.27 | 3.3VREG.4 68.12,57.01 | JP2.2 8,44.31 8,40 | EMITTERS.1 51.37,59.09 51.44,59.16 | 3.3VREG.4 68.16,56.46 | 8,40 16.93,40 JP2.9 | v73.38,21.43 73.91,19.43 76.83,16.51 76.83,6.99 v76.2,5.71
  Bottom 0.305: 65.91,26.9 70.25,26.9 73.66,23.5 73.66,21.71 v73.38,21.43 | 62.87,48 62.87,48.26 64.14,49.53 67.31,49.53 67.94,50.16 67.94,56.73 3.3VREG.4

### Text on the board
tNames: ECE477: Rock'Em Shock'Em Robots / Adrian Chupp / Amanda Dujmovich / Austin Wilhite / Dan Wilson